# Altium schematic sheet JETSON AGX SYS-PWR-GND.SchDoc: Jetson AGX SYS-PWR-GND
size 431 x 279 mm; CheckedBy: Lance Bantoto; Engineer: Cindy Li, Chealsie Bains; DocumentNumber: 6; Revision: 1; SheetNumber: 6; SheetTotal: 23
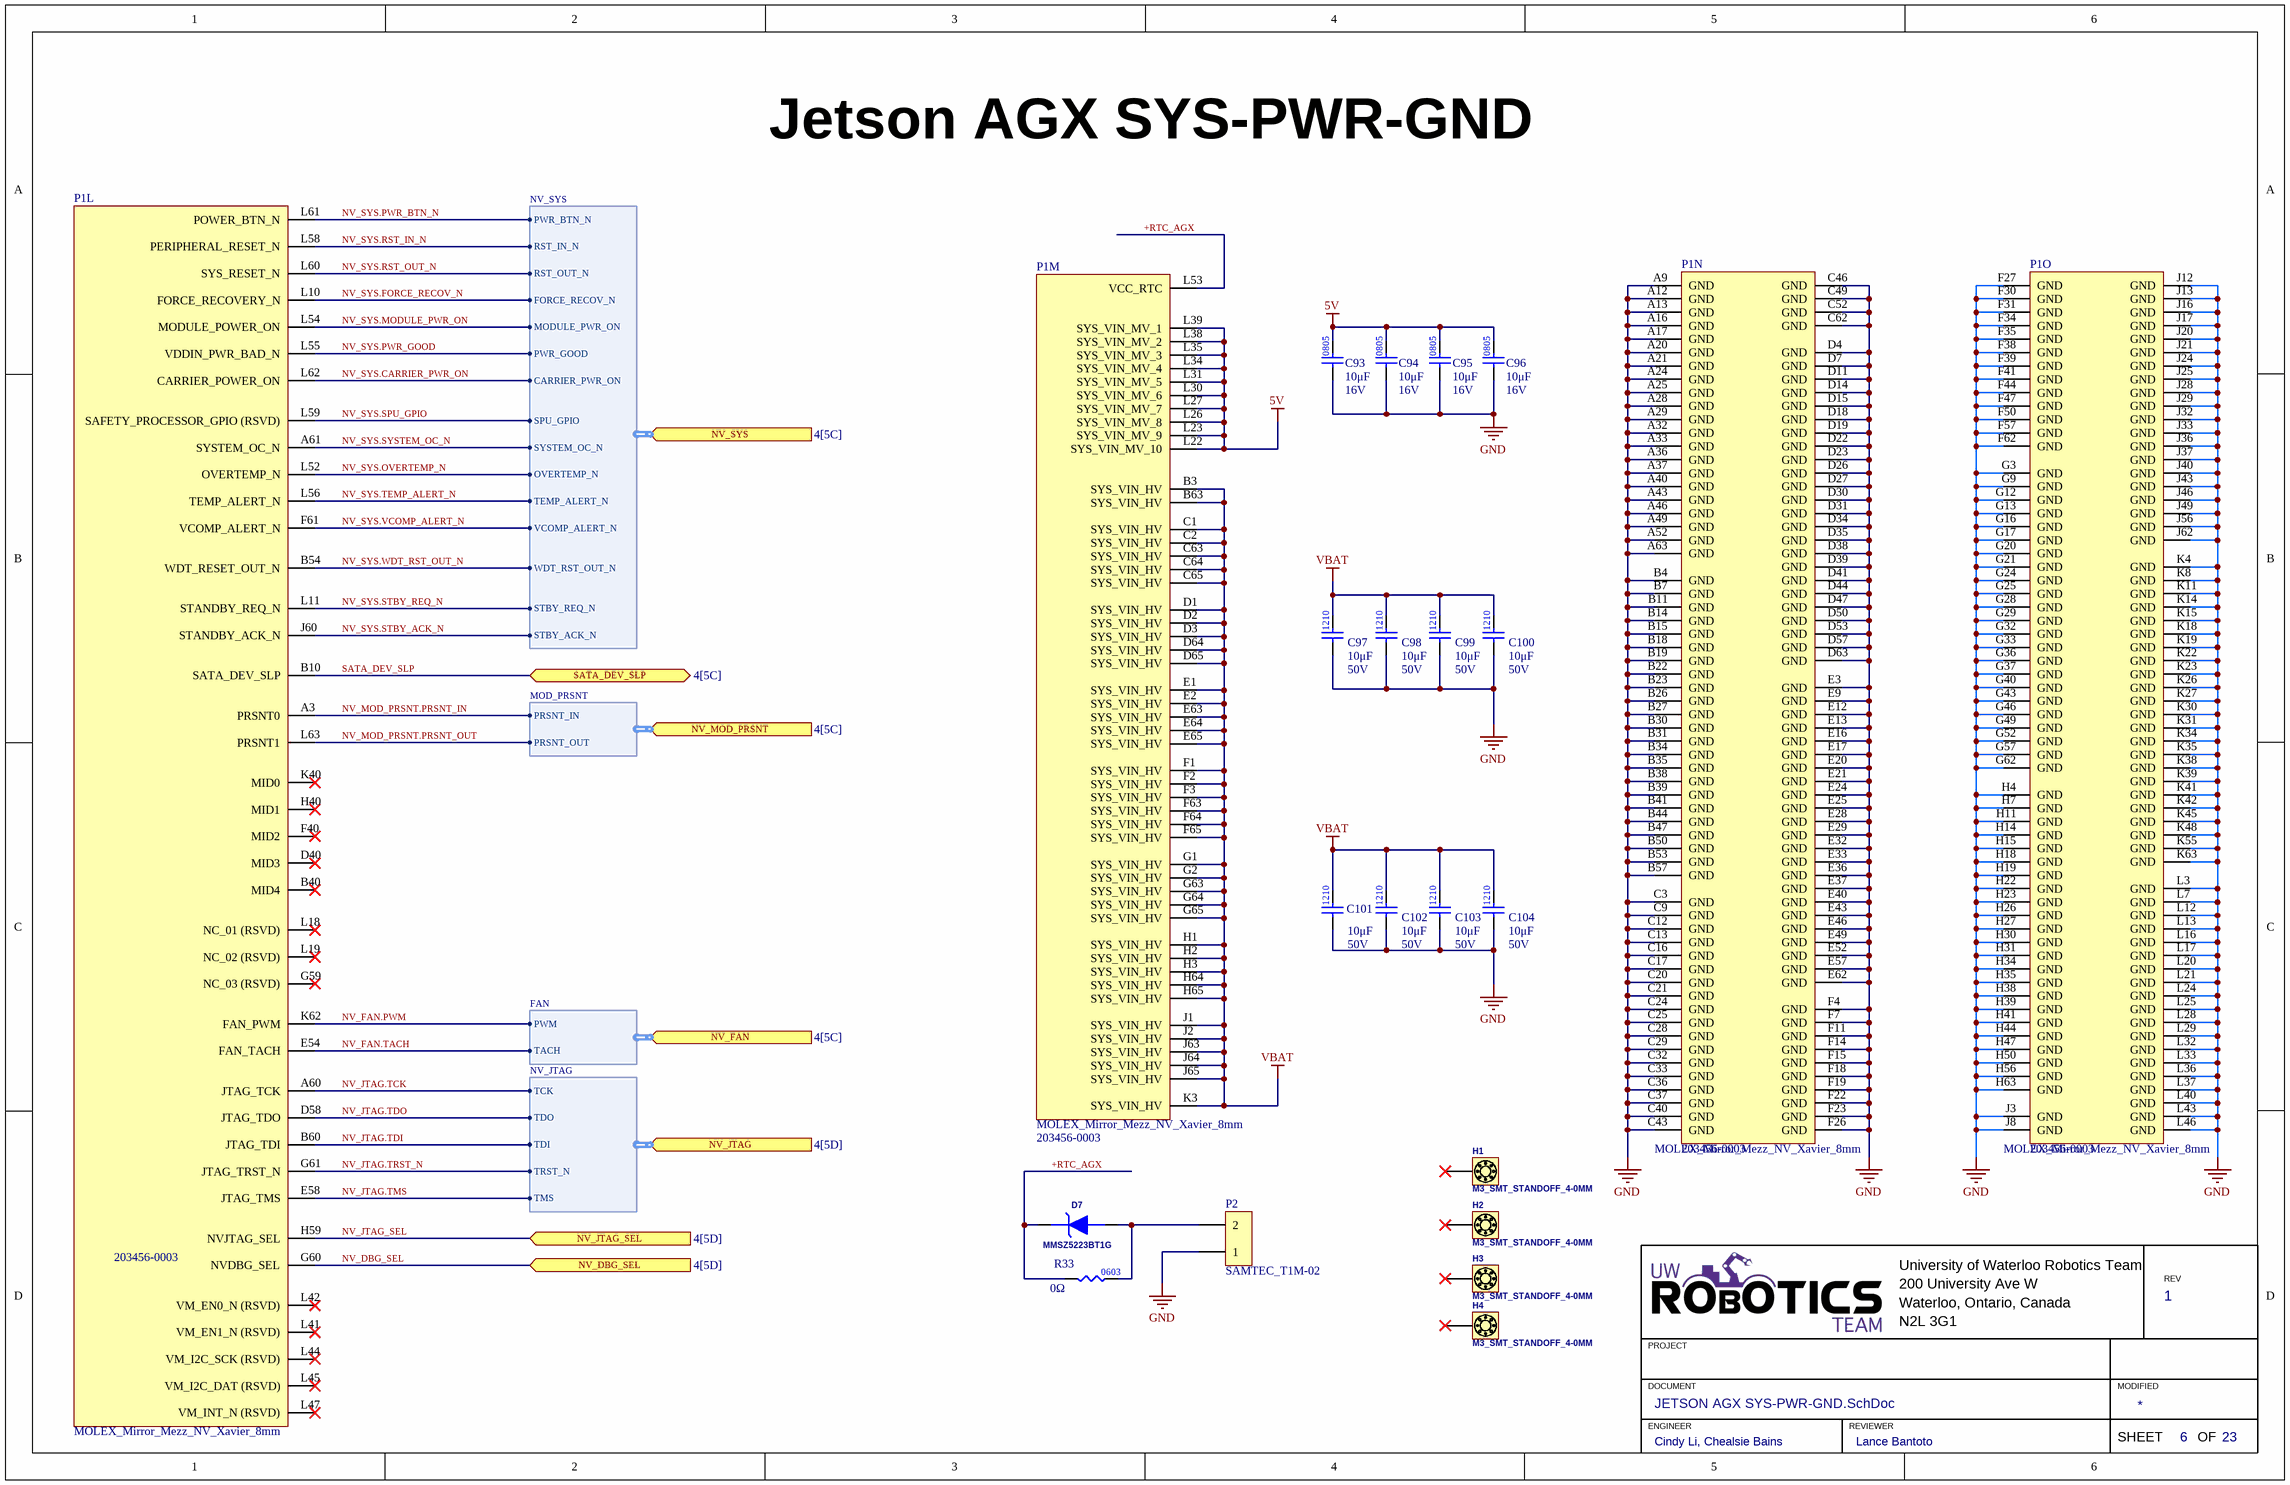
[diagram p0: JETSON AGX SYS-PWR-GND.SchDoc]

## Parts
C93  value 10μF  Voltage Rating: 16V  [CAP2012]  (hidden comment: CAP_10uF_16V_0805)
C94  value 10μF  Voltage Rating: 16V  [CAP2012]  (hidden comment: CAP_10uF_16V_0805)
C95  value 10μF  Voltage Rating: 16V  [CAP2012]  (hidden comment: CAP_10uF_16V_0805)
C96  value 10μF  Voltage Rating: 16V  [CAP2012]  (hidden comment: CAP_10uF_16V_0805)
C97  value 10μF  Voltage Rating: 50V  [CAP1210]  (hidden comment: CAP_10uF_50V_1210)
C98  value 10μF  Voltage Rating: 50V  [CAP1210]  (hidden comment: CAP_10uF_50V_1210)
C99  value 10μF  Voltage Rating: 50V  [CAP1210]  (hidden comment: CAP_10uF_50V_1210)
C100  value 10μF  Voltage Rating: 50V  [CAP1210]  (hidden comment: CAP_10uF_50V_1210)
C101  value 10μF  Voltage Rating: 50V  [CAP1210]  (hidden comment: CAP_10uF_50V_1210)
C102  value 10μF  Voltage Rating: 50V  [CAP1210]  (hidden comment: CAP_10uF_50V_1210)
C103  value 10μF  Voltage Rating: 50V  [CAP1210]  (hidden comment: CAP_10uF_50V_1210)
C104  value 10μF  Voltage Rating: 50V  [CAP1210]  (hidden comment: CAP_10uF_50V_1210)
D7  MMSZ5223BT1G  [ON SEMI SOD-123]
H1  M3_SMT_STANDOFF_4-0MM  [M3_SMT_4-0MM]
H2  M3_SMT_STANDOFF_4-0MM  [M3_SMT_4-0MM]
H3  M3_SMT_STANDOFF_4-0MM  [M3_SMT_4-0MM]
H4  M3_SMT_STANDOFF_4-0MM  [M3_SMT_4-0MM]
P1  MOLEX_Mirror_Mezz_NV_Xavier_8mm  [203456-0003]  (parts L,M,N,O of 15)
P2  SAMTEC_T1M-02  [T1M-02-F-SV-L]
R33  value 0Ω  [RES0603]  (hidden comment: RES_0Ω_0603)

## Ports
NV_DBG_SEL (in, see 4[5D]), NV_FAN (in, harness FAN, see 4[5C]), NV_JTAG (in, harness NV_JTAG, see 4[5D]), NV_JTAG_SEL (in, see 4[5D]), NV_MOD_PRSNT (in, harness MOD_PRSNT, see 4[5C]), NV_SYS (in, harness NV_SYS, see 4[5C]), SATA_DEV_SLP (bidir, see 4[5C])

## Harnesses
NV_JTAG: TCK, TDI, TDO, TMS, TRST_N
FAN: TACH, PWM
NV_SYS: PWR_BTN_N, RST_IN_N, RST_OUT_N, FORCE_RECOV_N, MODULE_PWR_ON, PWR_GOOD, CARRIER_PWR_ON, SPU_GPIO, SYSTEM_OC_N, OVERTEMP_N, TEMP_ALERT_N, VCOMP_ALERT_N, WDT_RST_OUT_N, STBY_REQ_N, STBY_ACK_N
MOD_PRSNT: PRSNT_IN, PRSNT_OUT

## Nets
5V: C93.2 C94.2 C95.2 C96.2 P1.L22(SYS_VIN_MV_10) P1.L23(SYS_VIN_MV_9) P1.L26(SYS_VIN_MV_8) P1.L27(SYS_VIN_MV_7) P1.L30(SYS_VIN_MV_6) P1.L31(SYS_VIN_MV_5) P1.L34(SYS_VIN_MV_4) P1.L35(SYS_VIN_MV_3) P1.L38(SYS_VIN_MV_2) P1.L39(SYS_VIN_MV_1)
GND: C93.1 C94.1 C95.1 C96.1 C97.1 C98.1 C99.1 C100.1 C101.1 C102.1 C103.1 C104.1 P1.A9(GND) P1.A12(GND) P1.A13(GND) P1.A16(GND) P1.A17(GND) P1.A20(GND) P1.A21(GND) P1.A24(GND) P1.A25(GND) P1.A28(GND) P1.A29(GND) P1.A32(GND) P1.A33(GND) P1.A36(GND) P1.A37(GND) P1.A40(GND) P1.A43(GND) P1.A46(GND) P1.A49(GND) P1.A52(GND) P1.A63(GND) P1.B4(GND) P1.B7(GND) P1.B11(GND) P1.B14(GND) P1.B15(GND) P1.B18(GND) P1.B19(GND) P1.B22(GND) P1.B23(GND) P1.B26(GND) P1.B27(GND) P1.B30(GND) P1.B31(GND) P1.B34(GND) P1.B35(GND) P1.B38(GND) P1.B39(GND) P1.B41(GND) P1.B44(GND) P1.B47(GND) P1.B50(GND) P1.B53(GND) P1.B57(GND) P1.C3(GND) P1.C9(GND) P1.C12(GND) P1.C13(GND) P1.C16(GND) P1.C17(GND) P1.C20(GND) P1.C21(GND) P1.C24(GND) P1.C25(GND) P1.C28(GND) P1.C29(GND) P1.C32(GND) P1.C33(GND) P1.C36(GND) P1.C37(GND) P1.C40(GND) P1.C43(GND) P1.C46(GND) P1.C49(GND) P1.C52(GND) P1.C62(GND) P1.D4(GND) P1.D7(GND) P1.D11(GND) P1.D14(GND) P1.D15(GND) P1.D18(GND) P1.D19(GND) P1.D22(GND) P1.D23(GND) P1.D26(GND) P1.D27(GND) P1.D30(GND) P1.D31(GND) P1.D34(GND) P1.D35(GND) P1.D38(GND) P1.D39(GND) P1.D41(GND) P1.D44(GND) P1.D47(GND) P1.D50(GND) P1.D53(GND) P1.D57(GND) P1.D63(GND) P1.E3(GND) P1.E9(GND) P1.E12(GND) P1.E13(GND) P1.E16(GND) P1.E17(GND) P1.E20(GND) P1.E21(GND) P1.E24(GND) P1.E25(GND) P1.E28(GND) P1.E29(GND) P1.E32(GND) P1.E33(GND) P1.E36(GND) P1.E37(GND) P1.E40(GND) P1.E43(GND) P1.E46(GND) P1.E49(GND) P1.E52(GND) P1.E57(GND) P1.E62(GND) P1.F4(GND) P1.F7(GND) P1.F11(GND) P1.F14(GND) P1.F15(GND) P1.F18(GND) P1.F19(GND) P1.F22(GND) P1.F23(GND) P1.F26(GND) P1.F27(GND) P1.F30(GND) P1.F31(GND) P1.F34(GND) P1.F35(GND) P1.F38(GND) P1.F39(GND) P1.F41(GND) P1.F44(GND) P1.F47(GND) P1.F50(GND) P1.F57(GND) P1.F62(GND) P1.G3(GND) P1.G9(GND) P1.G12(GND) P1.G13(GND) P1.G16(GND) P1.G17(GND) P1.G20(GND) P1.G21(GND) P1.G24(GND) P1.G25(GND) P1.G28(GND) P1.G29(GND) P1.G32(GND) P1.G33(GND) P1.G36(GND) P1.G37(GND) P1.G40(GND) P1.G43(GND) P1.G46(GND) P1.G49(GND) P1.G52(GND) P1.G57(GND) P1.G62(GND) P1.H4(GND) P1.H7(GND) P1.H11(GND) P1.H14(GND) P1.H15(GND) P1.H18(GND) P1.H19(GND) P1.H22(GND) P1.H23(GND) P1.H26(GND) P1.H27(GND) P1.H30(GND) P1.H31(GND) P1.H34(GND) P1.H35(GND) P1.H38(GND) P1.H39(GND) P1.H41(GND) P1.H44(GND) P1.H47(GND) P1.H50(GND) P1.H56(GND) P1.H63(GND) P1.J3(GND) P1.J8(GND) P1.J12(GND) P1.J13(GND) P1.J16(GND) P1.J17(GND) P1.J20(GND) P1.J21(GND) P1.J24(GND) P1.J25(GND) P1.J28(GND) P1.J29(GND) P1.J32(GND) P1.J33(GND) P1.J36(GND) P1.J37(GND) P1.J40(GND) P1.J43(GND) P1.J46(GND) P1.J49(GND) P1.J56(GND) P1.J62(GND) P1.K4(GND) P1.K8(GND) P1.K11(GND) P1.K14(GND) P1.K15(GND) P1.K18(GND) P1.K19(GND) P1.K22(GND) P1.K23(GND) P1.K26(GND) P1.K27(GND) P1.K30(GND) P1.K31(GND) P1.K34(GND) P1.K35(GND) P1.K38(GND) P1.K39(GND) P1.K41(GND) P1.K42(GND) P1.K45(GND) P1.K48(GND) P1.K55(GND) P1.K63(GND) P1.L3(GND) P1.L7(GND) P1.L12(GND) P1.L13(GND) P1.L16(GND) P1.L17(GND) P1.L20(GND) P1.L21(GND) P1.L24(GND) P1.L25(GND) P1.L28(GND) P1.L29(GND) P1.L32(GND) P1.L33(GND) P1.L36(GND) P1.L37(GND) P1.L40(GND) P1.L43(GND) P1.L46(GND) P2.1
VBAT: C97.2 C98.2 C99.2 C100.2 C101.2 C102.2 C103.2 C104.2 P1.B3(SYS_VIN_HV) P1.B63(SYS_VIN_HV) P1.C1(SYS_VIN_HV) P1.C2(SYS_VIN_HV) P1.C63(SYS_VIN_HV) P1.C64(SYS_VIN_HV) P1.C65(SYS_VIN_HV) P1.D1(SYS_VIN_HV) P1.D2(SYS_VIN_HV) P1.D3(SYS_VIN_HV) P1.D64(SYS_VIN_HV) P1.D65(SYS_VIN_HV) P1.E1(SYS_VIN_HV) P1.E2(SYS_VIN_HV) P1.E63(SYS_VIN_HV) P1.E64(SYS_VIN_HV) P1.E65(SYS_VIN_HV) P1.F1(SYS_VIN_HV) P1.F2(SYS_VIN_HV) P1.F3(SYS_VIN_HV) P1.F63(SYS_VIN_HV) P1.F64(SYS_VIN_HV) P1.F65(SYS_VIN_HV) P1.G1(SYS_VIN_HV) P1.G2(SYS_VIN_HV) P1.G63(SYS_VIN_HV) P1.G64(SYS_VIN_HV) P1.G65(SYS_VIN_HV) P1.H1(SYS_VIN_HV) P1.H2(SYS_VIN_HV) P1.H3(SYS_VIN_HV) P1.H64(SYS_VIN_HV) P1.H65(SYS_VIN_HV) P1.J1(SYS_VIN_HV) P1.J2(SYS_VIN_HV) P1.J63(SYS_VIN_HV) P1.J64(SYS_VIN_HV) P1.J65(SYS_VIN_HV) P1.K3(SYS_VIN_HV)
+RTC_AGX: D7.1(C) P1.L53(VCC_RTC) R33.1
NV_DBG_SEL: P1.G60(NVDBG_SEL) ; port NV_DBG_SEL
NV_FAN.PWM: P1.K62(FAN_PWM) ; port NV_FAN.PWM
NV_FAN.TACH: P1.E54(FAN_TACH) ; port NV_FAN.TACH
NV_JTAG.TCK: P1.A60(JTAG_TCK) ; port NV_JTAG.TCK
NV_JTAG.TDI: P1.B60(JTAG_TDI) ; port NV_JTAG.TDI
NV_JTAG.TDO: P1.D58(JTAG_TDO) ; port NV_JTAG.TDO
NV_JTAG.TMS: P1.E58(JTAG_TMS) ; port NV_JTAG.TMS
NV_JTAG.TRST_N: P1.G61(JTAG_TRST_N) ; port NV_JTAG.TRST_N
NV_JTAG_SEL: P1.H59(NVJTAG_SEL) ; port NV_JTAG_SEL
NV_MOD_PRSNT.PRSNT_IN: P1.A3(PRSNT0) ; port NV_MOD_PRSNT.PRSNT_IN
NV_MOD_PRSNT.PRSNT_OUT: P1.L63(PRSNT1) ; port NV_MOD_PRSNT.PRSNT_OUT
NV_SYS.CARRIER_PWR_ON: P1.L62(CARRIER_POWER_ON) ; port NV_SYS.CARRIER_PWR_ON
NV_SYS.FORCE_RECOV_N: P1.L10(FORCE_RECOVERY_N) ; port NV_SYS.FORCE_RECOV_N
NV_SYS.MODULE_PWR_ON: P1.L54(MODULE_POWER_ON) ; port NV_SYS.MODULE_PWR_ON
NV_SYS.OVERTEMP_N: P1.L52(OVERTEMP_N) ; port NV_SYS.OVERTEMP_N
NV_SYS.PWR_BTN_N: P1.L61(POWER_BTN_N) ; port NV_SYS.PWR_BTN_N
NV_SYS.PWR_GOOD: P1.L55(VDDIN_PWR_BAD_N) ; port NV_SYS.PWR_GOOD
NV_SYS.RST_IN_N: P1.L58(PERIPHERAL_RESET_N) ; port NV_SYS.RST_IN_N
NV_SYS.RST_OUT_N: P1.L60(SYS_RESET_N) ; port NV_SYS.RST_OUT_N
NV_SYS.SPU_GPIO: P1.L59(SAFETY_PROCESSOR_GPIO_(RSVD)) ; port NV_SYS.SPU_GPIO
NV_SYS.STBY_ACK_N: P1.J60(STANDBY_ACK_N) ; port NV_SYS.STBY_ACK_N
NV_SYS.STBY_REQ_N: P1.L11(STANDBY_REQ_N) ; port NV_SYS.STBY_REQ_N
NV_SYS.SYSTEM_OC_N: P1.A61(SYSTEM_OC_N) ; port NV_SYS.SYSTEM_OC_N
NV_SYS.TEMP_ALERT_N: P1.L56(TEMP_ALERT_N) ; port NV_SYS.TEMP_ALERT_N
NV_SYS.VCOMP_ALERT_N: P1.F61(VCOMP_ALERT_N) ; port NV_SYS.VCOMP_ALERT_N
NV_SYS.WDT_RST_OUT_N: P1.B54(WDT_RESET_OUT_N) ; port NV_SYS.WDT_RST_OUT_N
SATA_DEV_SLP: P1.B10(SATA_DEV_SLP) ; port SATA_DEV_SLP
NetD7_2: D7.2(A) P2.2 R33.2

Not connected (* = marked no-connect by the designer): H1 0*; H2 0*; H3 0*; H4 0*; P1 B40(MID4)* D40(MID3)* F40(MID2)* G59(NC_03_(RSVD))* H40(MID1)* K40(MID0)* L18(NC_01_(RSVD))* L19(NC_02_(RSVD))* L41(VM_EN1_N_(RSVD))* L42(VM_EN0_N_(RSVD))* L44(VM_I2C_SCK_(RSVD))* L45(VM_I2C_DAT_(RSVD))* L47(VM_INT_N_(RSVD))*

## Notes on the sheet
- University of Waterloo Robotics Team
- 200 University Ave W
- REV
- PROJECT
- Waterloo, Ontario, Canada
- N2L 3G1
- DOCUMENT
- ENGINEER
- REVIEWER
- MODIFIED
- SHEET
- OF
- (in symbol CAP_10uF_50V_1210) 1210

## Library data of the parts
C93-C96 = CAP_10uF_16V_0805: CAP CER 10UF 16V X5R 0805; Manufacturer 1: Yageo; Manufacturer Part Number 1: CC0805KKX5R7BB106; Package/Footprint: 0805; Dielectric: X5R; Supplier 1: Digi-Key; Supplier Part Number 1: 311-1865-1-ND; Mounting Type: SMD
C97-C104 = CAP_10uF_50V_1210: CAP CER 10UF 50V X7R 1210; Manufacturer 1: Murata Electronics; Manufacturer Part Number 1: GRM32ER71H106MA12L; Dielectric: X7R; Supplier 1: Digi-Key; Supplier Part Number 1: 490-12775-1-ND
D7 = MMSZ5223BT1G: DIODE ZENER 2.7V 500MW SOD123; Manufacturer 1: On Semiconductor; Forward Voltage: 900mV @ 10mA; Voltage - Zener: 2.7V; Power - Max: 500mW; Package: SOD-123
H1-H4 = M3_SMT_STANDOFF_4-0MM: ROUND STANDOFF M3X0.5 STEEL 4MM; Manufacturer 1: Würth Elektronik; Manufacturer Part Number 1: 9774040360R; Supplier 1: Digi-Key; Supplier Part Number 1: 732-5271-1-ND
P1 = MOLEX_Mirror_Mezz_NV_Xavier_8mm: CONN SELF-MATE 699POS SMD GOLD; Manufacturer 1: Molex; Supplier 1: Digi-Key; Supplier Part Number 1: WM25528CT-ND; Manufacturer Part Number 1: 203456-0003
P2 = SAMTEC_T1M-02-F-SV-L: CONN HEADER SMD 2POS 1MM; Manufacturer 1: Samtec; Manufacturer Part Number 1: T1M-02-F-SV-L; Supplier 1: Digi-Key; Supplier Part Number 1: SAM15469CT-ND
R33 = RES_0Ω_0603: RES 0 OHM JUMPER 1/10W 0603; Manufacturer 1: Yageo; Manufacturer Part Number 1: RC0603JR-070RL; Supplier Part Number 1: 311-0.0GRCT-ND; Supplier 1: Digi-Key; Mounting Type: SMD; Package: 0603